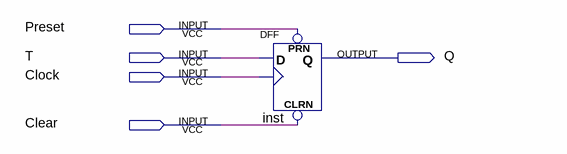
[diagram p0: schematic sheet]
// Quartus schematic FLIPFLOP_D.bdf as structural Verilog: 1 symbols, 5 pins
module FLIPFLOP_D (
  input  Preset,
  input  T,
  input  Clock,
  input  Clear,
  output Q
);

  DFF inst (.CLRN(Clear), .CLK(Clock), .D(T), .PRN(Preset), .Q(Q));
endmodule
